# EAGLE design protoflo (EAGLE 5.11)
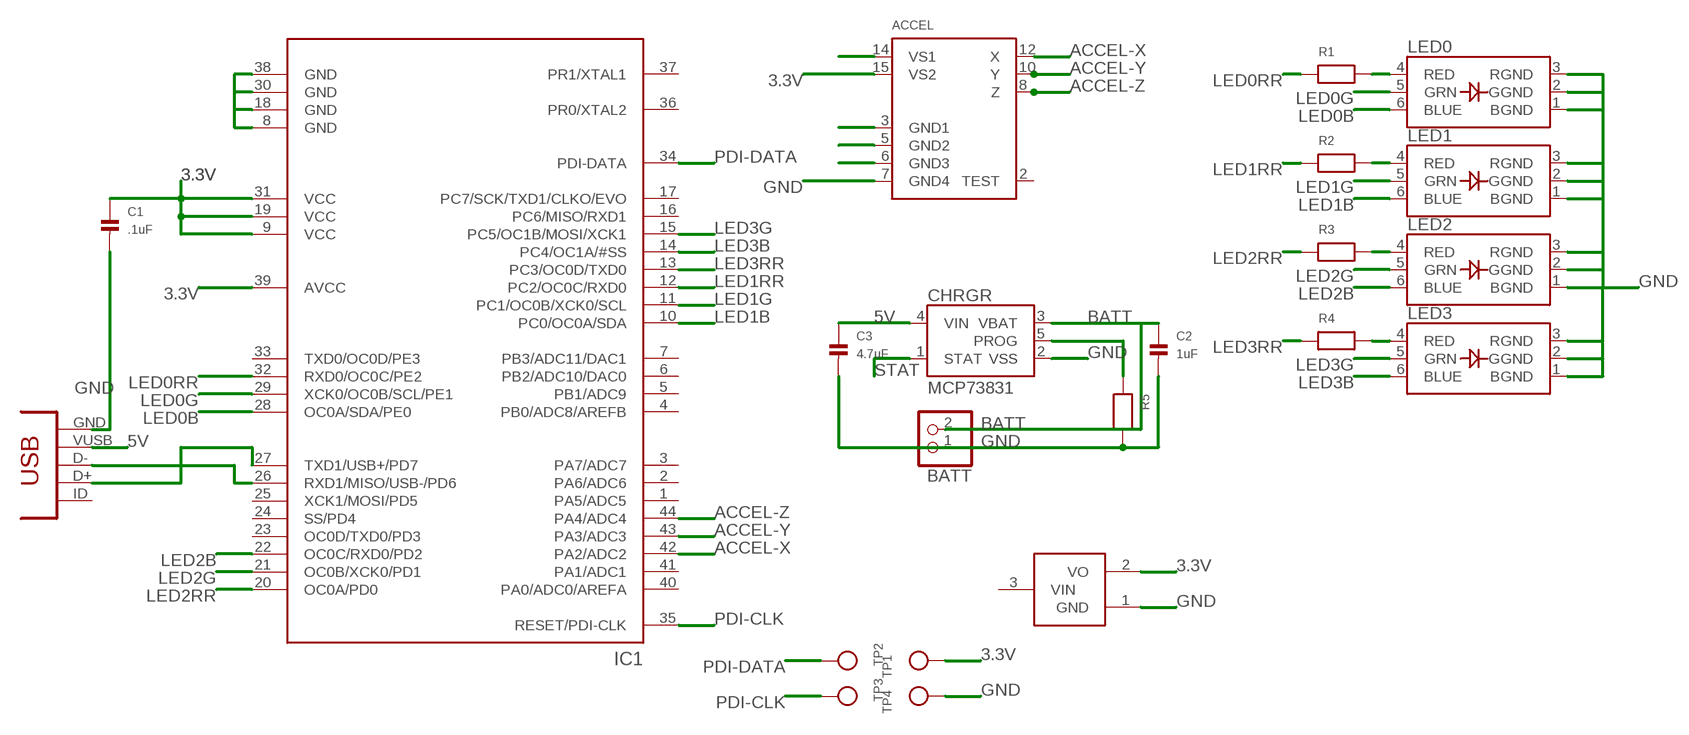
[diagram p0: schematic, sheet 1]

## Parts
3.3V  VREG  [SOT23-3]
ACCEL  ADXL3XX  [LFCSP-16]
BATT  HEADER-1X2ROUND  [1X02_ROUND]
C1  .1uF  CAP_CERAMIC0603  [0603]
C2  1uF  CAP_CERAMIC0603  [0603]
C3  4.7uF  CAP_CERAMIC0603  [0603]
CHRGR  MCP73831  [SOT23-5]
IC1  ATXMEGAXXA4U  [TQFP-44]
LED0  LED_RGB_PLCC6CREE-CLV6A  [RGBLED_PLCC6]
LED1  LED_RGB_PLCC6CREE-CLV6A  [RGBLED_PLCC6]
LED2  LED_RGB_PLCC6CREE-CLV6A  [RGBLED_PLCC6]
LED3  LED_RGB_PLCC6CREE-CLV6A  [RGBLED_PLCC6]
R1  RESISTOR0603  [0603]
R2  RESISTOR0603  [0603]
R3  RESISTOR0603  [0603]
R4  RESISTOR0603  [0603]
R5  RESISTOR0603  [0603]
TP1  TESTPOINTROUND2MM  [TESTPOINT_ROUND_2MM]
TP2  TESTPOINTROUND2MM  [TESTPOINT_ROUND_2MM]
TP3  TESTPOINTROUND2MM  [TESTPOINT_ROUND_2MM]
TP4  TESTPOINTROUND2MM  [TESTPOINT_ROUND_2MM]
USB1  USB-MINI-BUSB1  [CONN_USB_MINI-B]

## Nets
3.3V: 3.3V.2(VO) ACCEL.14(VS1) ACCEL.15(VS2) C1.1 IC1.9(VCC) IC1.19(VCC) IC1.31(VCC) IC1.39(AVCC) TP1.P$1
5V: C3.1 CHRGR.4(VIN) USB1.VUSB
ACCEL-X: ACCEL.12(X) IC1.42(PA2/ADC2)
ACCEL-Y: ACCEL.10(Y) IC1.43(PA3/ADC3)
ACCEL-Z: ACCEL.8(Z) IC1.44(PA4/ADC4)
BATT: BATT.2 C2.1 CHRGR.3(VBAT)
D+: IC1.27(TXD1/USB+/PD7) USB1.D+
D-: IC1.26(RXD1/MISO/USB-/PD6) USB1.D-
GND: 3.3V.1(GND) ACCEL.3(GND1) ACCEL.5(GND2) ACCEL.6(GND3) ACCEL.7(GND4) BATT.1 C1.2 C2.2 C3.2 CHRGR.2(VSS) IC1.8(GND) IC1.18(GND) IC1.30(GND) IC1.38(GND) LED0.1(BGND) LED0.2(GGND) LED0.3(RGND) LED1.1(BGND) LED1.2(GGND) LED1.3(RGND) LED2.1(BGND) LED2.2(GGND) LED2.3(RGND) LED3.1(BGND) LED3.2(GGND) LED3.3(RGND) R5.2 TP4.P$1 USB1.GND
LED0B: IC1.28(OC0A/SDA/PE0) LED0.6(BLUE)
LED0G: IC1.29(XCK0/OC0B/SCL/PE1) LED0.5(GRN)
LED0R: LED0.4(RED) R1.2
LED0RR: IC1.32(RXD0/OC0C/PE2) R1.1
LED1B: IC1.10(PC0/OC0A/SDA) LED1.6(BLUE)
LED1G: IC1.11(PC1/OC0B/XCK0/SCL) LED1.5(GRN)
LED1R: LED1.4(RED) R2.2
LED1RR: IC1.12(PC2/OC0C/RXD0) R2.1
LED2B: IC1.22(OC0C/RXD0/PD2) LED2.6(BLUE)
LED2G: IC1.21(OC0B/XCK0/PD1) LED2.5(GRN)
LED2R: LED2.4(RED) R3.2
LED2RR: IC1.20(OC0A/PD0) R3.1
LED3B: IC1.14(PC4/OC1A/#SS) LED3.6(BLUE)
LED3G: IC1.15(PC5/OC1B/MOSI/XCK1) LED3.5(GRN)
LED3R: LED3.4(RED) R4.2
LED3RR: IC1.13(PC3/OC0D/TXD0) R4.1
N$2: CHRGR.5(PROG) R5.1
PDI-CLK: IC1.35(RESET/PDI-CLK) TP3.P$1
PDI-DATA: IC1.34(PDI-DATA) TP2.P$1
STAT: CHRGR.1(STAT)
Unconnected: 3.3V.3(VIN) ACCEL.2(TEST) IC1.1(PA5/ADC5) IC1.2(PA6/ADC6) IC1.3(PA7/ADC7) IC1.4(PB0/ADC8/AREFB) IC1.5(PB1/ADC9) IC1.6(PB2/ADC10/DAC0) IC1.7(PB3/ADC11/DAC1) IC1.16(PC6/MISO/RXD1) IC1.17(PC7/SCK/TXD1/CLKO/EVO) IC1.23(OC0D/TXD0/PD3) IC1.24(SS/PD4) IC1.25(XCK1/MOSI/PD5) IC1.33(TXD0/OC0D/PE3) IC1.36(PR0/XTAL2) IC1.37(PR1/XTAL1) IC1.40(PA0/ADC0/AREFA) IC1.41(PA1/ADC1) USB1.BODY@1(BODY) USB1.BODY@2(BODY) USB1.BODY@3(BODY) USB1.BODY@4(BODY) USB1.ID(USBID)

## Library data of the parts
3.3V = nonolith:VREG
ACCEL = nonolith:ADXL3XX: ADXL3XX Low-Power 3 Axis Accelerometer LFCSP16-R - 16 Pin LFCSP Package (Reflow footprint) LFSCP16-W - 16 Pin LFCSP Package (Wave footprint with extended pads for hand soldering)
BATT = nonolith:HEADER-1X2: PIN HEADER
C1-C3 = nonolith:CAP_CERAMIC: Ceramic Capacitors 0402 - 0402 Surface Mount Capacitors 0.1uF 10V 10% [Digikey: 490-1318-2-ND] 0603 - 0603 Surface Mount Capacitors 16 pF 50V 5% [Digikey: 445-5051-2-ND] 22 pF 50V [Digikey: PCC220ACVTR-ND] 33 pF 50V 5% [Digikey: 490-1415-1-ND] 56pF 50V 5% [Digikey: 490-1421-1-ND] 220pF 50V 5% [Digikey: 445-1285-1-ND] 680 pF 50V 2200 pF 50V 5% C0G [Digikey: 445-1297-1-ND] 5600 pF 100V 5% X7R [Digikey: 478-3711-1-ND] 0.1 µF 25V 10% [Digikey: PCC2277TR-ND] 0.22 µF 16V 10% X7R [Digikey: 445-1318-1-ND] 1.0 µF 25V 10% [Digikey: 445-5146-2-ND] 0603 - RF Specific 3pF 250V +/-0.1pF RF [Digikey: 712-1347-1-ND] 18 pF 250V 5% [Digikey: 478-3505-1-ND or 712-1322-1-ND] 56 pF 250V 5% C0G RF [Digikey: 490-4867-1-ND] 68 pF 250V RF [Digikey: 490-4868-1-ND] 0805 - 0805 Surface Mount Capacitors 220 pF 250V 2% RF Ceramic Capacitor [Digikey: 712-1398-1-ND] 1000 pF 50V 2% NP0 Ceramic Capacitor [Digikey: 478-3760-1-ND] 0.1 µF 25V 10% Ceramic Capacitor [Digikey: PCC1828TR-ND] 1.0 µF 16V 10% Ceramic Capacitor[Digikey: 490-1691-2-ND] 10.0 µF 10V 10% Ceramic Capacitor[Digikey: 709-1228-1-ND] 1206 - 1206 Surface Mount Capacitors
CHRGR = SparkFun:MCP73831: Microchip's MCP73831 Miniature single cell, fully integrated Li-Ion, Li-polymer charge management controller http://ww1.microchip.com/downloads/en/DeviceDoc/21984a.pdf
IC1 = nonolith:ATXMEGAXXA4U: ATXMEGA A4U Series (XMEGA+USB)
LED0 LED1-LED3 = microbuilder:LED_RGB_PLCC6: RGB LED Cree CLV6A-FKB - Digikey: CLV6A-FKB-CK1P1G1BB7R3R3TR-ND DC Foreward Current: 20mA Foreward Voltage: R = 2.0, G = 3.2, B = 3.2 Viewing Angle: 120°
R1-R5 = nonolith:RESISTOR: Resistors 0402 - 0402 Surface Mount Package 10.0K 1% 1/16W [Digikey: 311-10.0KLRTR-ND] 0603 - 0603 Surface Mount Package 0 Ohm 1/10 Watt 1% Resistor 15 Ohm 1/10 Watt 1% Resistor 33 Ohm 1/10 Watt 1% Resistor 49.9 Ohm 1/10 Watt 1% Resistor 100 Ohm 1/10 Watt 1% Resistor 150 Ohm 1/10 Watt 1% Resistor 240 Ohm 1/10 Watt 1% Resistor 390 Ohm 1/10 Watt 1% Resistor 560 Ohm 1/10 Watt 1% Resistor 750 Ohm 1/10 Watt 1% Resistor 1.0K Ohm 1/10 Watt 1% Resistor 1.5K Ohm 1/10 Watt 1% Resistor 2.0K Ohm 1/10 Watt 1% Resistor 4.7K Ohm 1/10 Watt 1% Resistor 10.0K Ohm 1/10 Watt 1% Resistor 20.0K Ohm 1/10 Watt 1% Resistor 33.0K Ohm 1/10 Watt 1% Resistor 100.0K Ohm 1/10 Watt 1% Resistor 0805 - 0805 Surface Mount Package 0 Ohm 1/8 Watt 1% Resistor 33 Ohm 1/8 Watt 1% Resistor 100 Ohm 1/8 Watt 1% Resistor 150 Ohm 1/8 Watt 1% Resistor 200 Ohm 1/8 Watt 1% Resistor 240 Ohm 1/8 Watt 1% Resistor 330 Ohm 1/8 Watt 1% Resistor 390 Ohm 1/8 Watt 1% Resistor 470 Ohm 1/8 Watt 1% Resistor 1.0K Ohm 1/8 Watt 1% Resistor 1.5K Ohm 1/8 Watt 1% Resistor 2.0K Ohm 1/8 Watt 1% Resistor 4.7K Ohm 1/8 Watt 1% Resistor 5.1K Ohm 1/8 Watt 1% Resistor 5.6K Ohm 1/8 Watt 1% Resistor 10.0K Ohm 1/8 Watt 1% Resistor 22.0K Ohm 1/8 Watt 1% Resistor 33.0K Ohm 1/8 Watt 1% Resistor 100K Ohm 1/8 Watt 1% Resistor 1206 - 1206 Surface Mount Package
TP1-TP4 = microbuilder:TESTPOINT: Test Point TESTPOINT_SMT - Compact Surface Mount Test Point [Digikey: 5016KTR-ND] TESTPOINT_PAD - Square Pad (2mm) TESTPOINT_SMT - Round Pad (2mm) TESTPOINT_0.1" - 0.1" Header
USB1 = nonolith:USB-MINI-B: USB connector

## Net classes
0 default: width 0.254 mm, clearance 0.127 mm

## Board
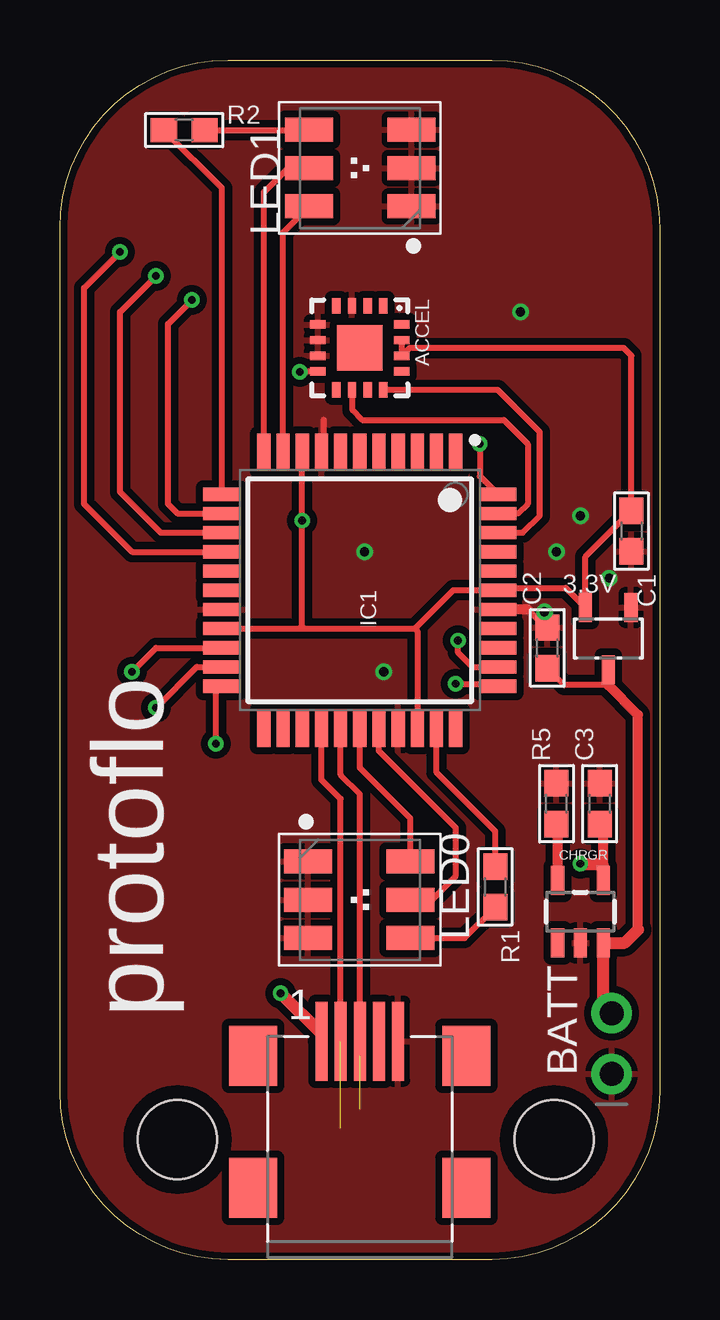
[diagram p1: board, top side]
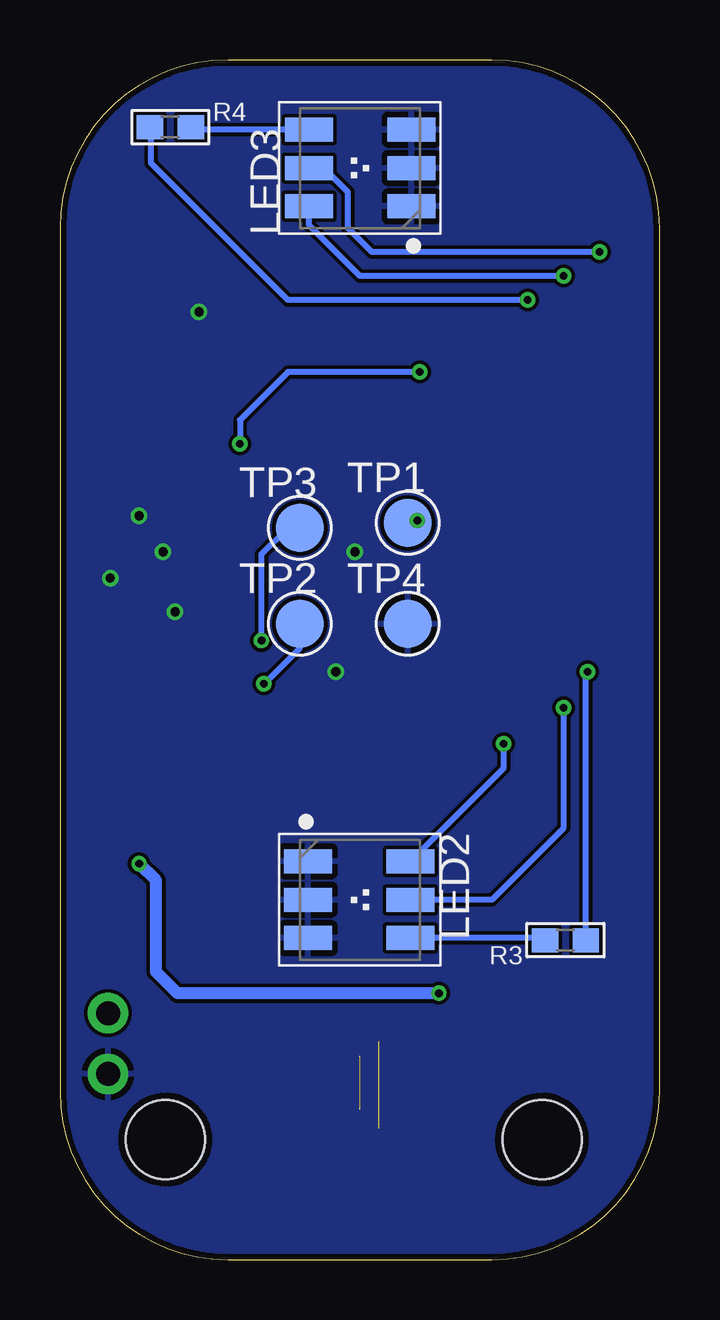
[diagram p2: board, bottom side, seen from below]

Size 25 x 50 mm. Coordinates in mm from the lower left corner, seen from the top.
Outline: 0,43 arc-90 7,50 18,50 arc-90 25,43 25,7 arc-90 18,0 7,0 arc-90 0,7 0,43
Copper layers (1*16): Top 0.035mm / dielectric 1.5mm / Bottom 0.035mm
Design rules "Fusion_eagle_rule_v1.1 *": minimum track width 6mil, minimum drill 12mil, track to track 6mil, track to pad 6mil, pad to pad 6mil, via to via 6mil, smd to smd 0mil, copper to edge 10mil, drill to drill 10mil, minimum pad ring 10mil, minimum via ring 6mil, stop-mask expansion 2mil, vias tented up to drill 0mil, thermal gap 10mil

### Footprints (pad centres in the part's own frame; a part is rotated, then mirrored left to right if it is on the bottom)
SOT23-3 = smd 0.55 x 1.2: 1 0.95,1.3; 2 -0.95,1.3; 3 0,-1.3
LFCSP-16 = smd 1.9 x 1.9: 0 0,0 | smd 0.65 x 0.35: 1 -1.75,0.975; 2 -1.75,0.325; 3 -1.75,-0.325; 4 -1.75,-0.975; 9 1.75,-0.975; 10 1.75,-0.325; 11 1.75,0.325; 12 1.75,0.975 | smd 0.35 x 0.65: 5 -0.975,-1.75; 6 -0.325,-1.75; 7 0.325,-1.75; 8 0.975,-1.75; 13 0.975,1.75; 14 0.325,1.75; 15 -0.325,1.75; 16 -0.975,1.75
1X02_ROUND = drill 1 pad 1.676 round: 1 -1.27,0; 2 1.27,0
0603 = smd 1.1 x 1: 1 -0.85,0; 2 0.85,0
SOT23-5 = smd 0.55 x 1.2: 1 -0.95,-1.3; 2 0,-1.3; 3 0.95,-1.3; 4 0.95,1.3; 5 -0.95,1.3
TQFP-44 = smd 1.55 x 0.55: 1 -5.75,4; 2 -5.75,3.2; 3 -5.75,2.4; 4 -5.75,1.6; 5 -5.75,0.8; 6 -5.75,0; 7 -5.75,-0.8; 8 -5.75,-1.6; 9 -5.75,-2.4; 10 -5.75,-3.2; 11 -5.75,-4; 23 5.75,-4; 24 5.75,-3.2; 25 5.75,-2.4; 26 5.75,-1.6; 27 5.75,-0.8; 28 5.75,0; 29 5.75,0.8; 30 5.75,1.6; 31 5.75,2.4; 32 5.75,3.2; 33 5.75,4 | smd 0.55 x 1.55: 12 -4,-5.75; 13 -3.2,-5.75; 14 -2.4,-5.75; 15 -1.6,-5.75; 16 -0.8,-5.75; 17 0,-5.75; 18 0.8,-5.75; 19 1.6,-5.75; 20 2.4,-5.75; 21 3.2,-5.75; 22 4,-5.75; 34 4,5.75; 35 3.2,5.75; 36 2.4,5.75; 37 1.6,5.75; 38 0.8,5.75; 39 0,5.75; 40 -0.8,5.75; 41 -1.6,5.75; 42 -2.4,5.75; 43 -3.2,5.75; 44 -4,5.75
RGBLED_PLCC6 = smd 1 x 2: 1 -1.6,-2.158; 2 0,-2.158; 3 1.6,-2.158; 4 1.6,2.108; 5 0,2.108; 6 -1.6,2.108
TESTPOINT_ROUND_2MM = smd 2 x 2: P$1 0,0
STAND-OFF = hole 3.302: 0,0
CONN_USB_MINI-B = smd 2 x 2.5: BODY@1 -4.45,2.5; BODY@2 4.45,2.5; BODY@3 4.45,-3; BODY@4 -4.45,-3 | smd 0.5 x 3.3: D+ 0,3.1; D- -0.8,3.1; GND 1.6,3.1; ID 0.8,3.1; VUSB -1.6,3.1

### Placement (x,y rotation side)
3.3V  22.86,25.88 0 top
ACCEL  12.5,38 270 top
BATT  23,9 90 top
C1  23.83,30.36 270 top
C2  20.32,25.49 90 top
C3  22.5,19 90 top
CHRGR  21.7,14.5 0 top
IC1  12.5,27.9 270 top
LED0  12.5,15 270 top
LED1  12.5,45.5 90 top
LED2  12.5,15 270 bottom
LED3  12.5,45.5 90 bottom
R1  18.15,15.53 270 top
R2  5.18,47.08 0 top
R3  3.92,13.31 180 bottom
R4  20.4,47.2 0 bottom
R5  20.7,19 90 top
TP1  10.5,30.7 0 bottom
TP2  15,26.5 0 bottom
TP3  15,30.5 0 bottom
TP4  10.5,26.5 0 bottom
U$1  [STAND-OFF]  4.9,5 0 top
U$2  [STAND-OFF]  20.6,5 0 top
USB1  12.5,6 0 top

### Tracks (layer width: path | path; a pad name or v marks a point on that pad's centre or on a via)
3.3V  (via drill 0.33)
  Top 0.254: 14.8,26.3 16.4,27.9 IC1.39 18.35,28 21.09,28 3.3V.2 21.91,29.3 C1.1 23.83,37.67 23.5,38 14.57,38 | 14.8,26.3 14.9,26.2 IC1.31 | IC1.19 10,26.3 | 10,26.3 14.8,26.3 | IC1.9 v10.1,30.8 10.1,26.4 10,26.3 | ACCEL.14 ACCEL.15 | 14.57,38 ACCEL.14 | 14.57,38 ACCEL.14
  Bottom 0.254: v10.1,30.8 10.2,30.7 TP1.P$1
5V  (via drill 0.33)
  Top 0.406: CHRGR.4 22.65,16.4 22.65,17.92 C3.1
  Top 0.508: USB1.VUSB 10.9,9.4 v9.2,11.1 | v21.7,16.5 22.55,16.5 22.65,16.4
  Bottom 0.508: v9.2,11.1 20.1,11.1 21,12 21,15.8 v21.7,16.5
ACCEL-X
  Top 0.254: ACCEL.12 18.25,36.25 20,34.5 20,31 19.3,30.3 IC1.42
ACCEL-Y
  Top 0.254: ACCEL.10 12.2,36.23 12.2,35.4 12.6,35 18.5,35 19.5,34 19.5,31.5 19.1,31.1 IC1.43
ACCEL-Z  (via drill 0.33)
  Top 0.254: ACCEL.8 10.03,37.02 v10,37 | v17.5,34 17.5,32.65 IC1.44
  Bottom 0.254: v10,37 15.5,37 17.5,35 v17.5,34
BATT
  Top 0.254: 20.38,24.58 21.03,23.94 22.86,23.94
  Top 0.406: 22.86,23.94 24.1,22.7 24.1,13.75
  Top 0.508: 20.38,24.58 C2.1 | 24.1,13.75 23.55,13.2 CHRGR.3 22.65,10.62 BATT.2
D+  (1 unrouted)
  Top 0.254: IC1.27 11.7,20.2 12.5,19.4 USB1.D+ 12.5,8.5
D-  (1 unrouted)
  Top 0.254: USB1.D- 11.7,19.2 10.9,20 IC1.26
GND  (via drill 0.38)
  Top 0.254: 19.5,27.1 20.25,26.34 C2.2 20.2,26.46 v20.2,27 | IC1.8 11,33.75 11,35
  Top 0.406: 19.5,27.1 IC1.38
  other vias: 21.7,31 13.5,24.5 22.9,28.4 20.7,29.5 19.2,39.5 12.7,29.5
  pour Top (isolate 0.305): -1,0 -1,50 25,50 25,0
  pour Bottom: -0.5,0 25,0 25,50 -0.5,50
LED0B
  Top 0.254: IC1.28 12.5,20.5 14.61,18.39 LED0.6
LED0G
  Top 0.254: LED0.5 15.5,15 16.5,16 16.5,18 13.3,21.2 IC1.29
LED0R
  Top 0.254: LED0.4 16.87,13.4 R1.2
LED0RR
  Top 0.254: IC1.32 15.7,20.3 18.15,17.85 R1.1
LED1B
  Top 0.254: IC1.10 9.3,42.81 LED1.6
LED1G
  Top 0.254: IC1.11 8.5,44.5 9.5,45.5 LED1.5
LED1R
  Top 0.254: R2.2 10.39,47.08 LED1.4
LED1RR
  Top 0.254: IC1.12 6.75,44.66 R2.1
LED2B  (via drill 0.33)
  Top 0.254: v6.5,21.5 6.5,23.65 IC1.22
  Bottom 0.254: LED2.6 6.5,20.49 v6.5,21.5
LED2G  (via drill 0.33)
  Top 0.254: v4,23 5.7,24.7 IC1.21
  Bottom 0.254: LED2.5 7,15 4,18 v4,23
LED2R
  Bottom 0.254: LED2.4 4.86,13.4 R3.2
LED2RR  (via drill 0.33)
  Top 0.254: v3,24.5 4,25.5 IC1.20
  Bottom 0.254: R3.1 3.07,24.43 v3,24.5
LED3B  (via drill 0.33)
  Top 0.254: IC1.14 4.2,30.3 2.5,32 2.5,39.5 v4,41
  Bottom 0.254: LED3.6 14.61,43.11 12.5,41 v4,41
LED3G  (via drill 0.33)
  Top 0.254: IC1.15 3,29.5 1,31.5 1,40.5 v2.5,42
  Bottom 0.254: LED3.5 14,45.5 13,44.5 13,43 12,42 v2.5,42
LED3R
  Bottom 0.254: LED3.4 19.45,47.1 R4.2
LED3RR  (via drill 0.33)
  Top 0.254: v5.5,40 4.5,39 4.5,31.5 4.9,31.1 IC1.13
  Bottom 0.254: R4.1 21.2,47.2 21.2,45.7 15.5,40 v5.5,40
N$2
  Top 0.406: CHRGR.5 20.75,18.1 R5.1
PDI-CLK  (via drill 0.33)
  Top 0.254: IC1.35 17.2,24.7 16.6,25.3 v16.6,25.8
  Bottom 0.254: v16.6,25.8 16.6,29.4 15.5,30.5 TP3.P$1
PDI-DATA  (via drill 0.33)
  Top 0.254: IC1.34 18.15,24 v16.5,24
  Bottom 0.254: v16.5,24 15,25.5 TP2.P$1

### Text on the board
tNames: protoflo